# EAGLE design FanControllerv11 (EAGLE 6.4)
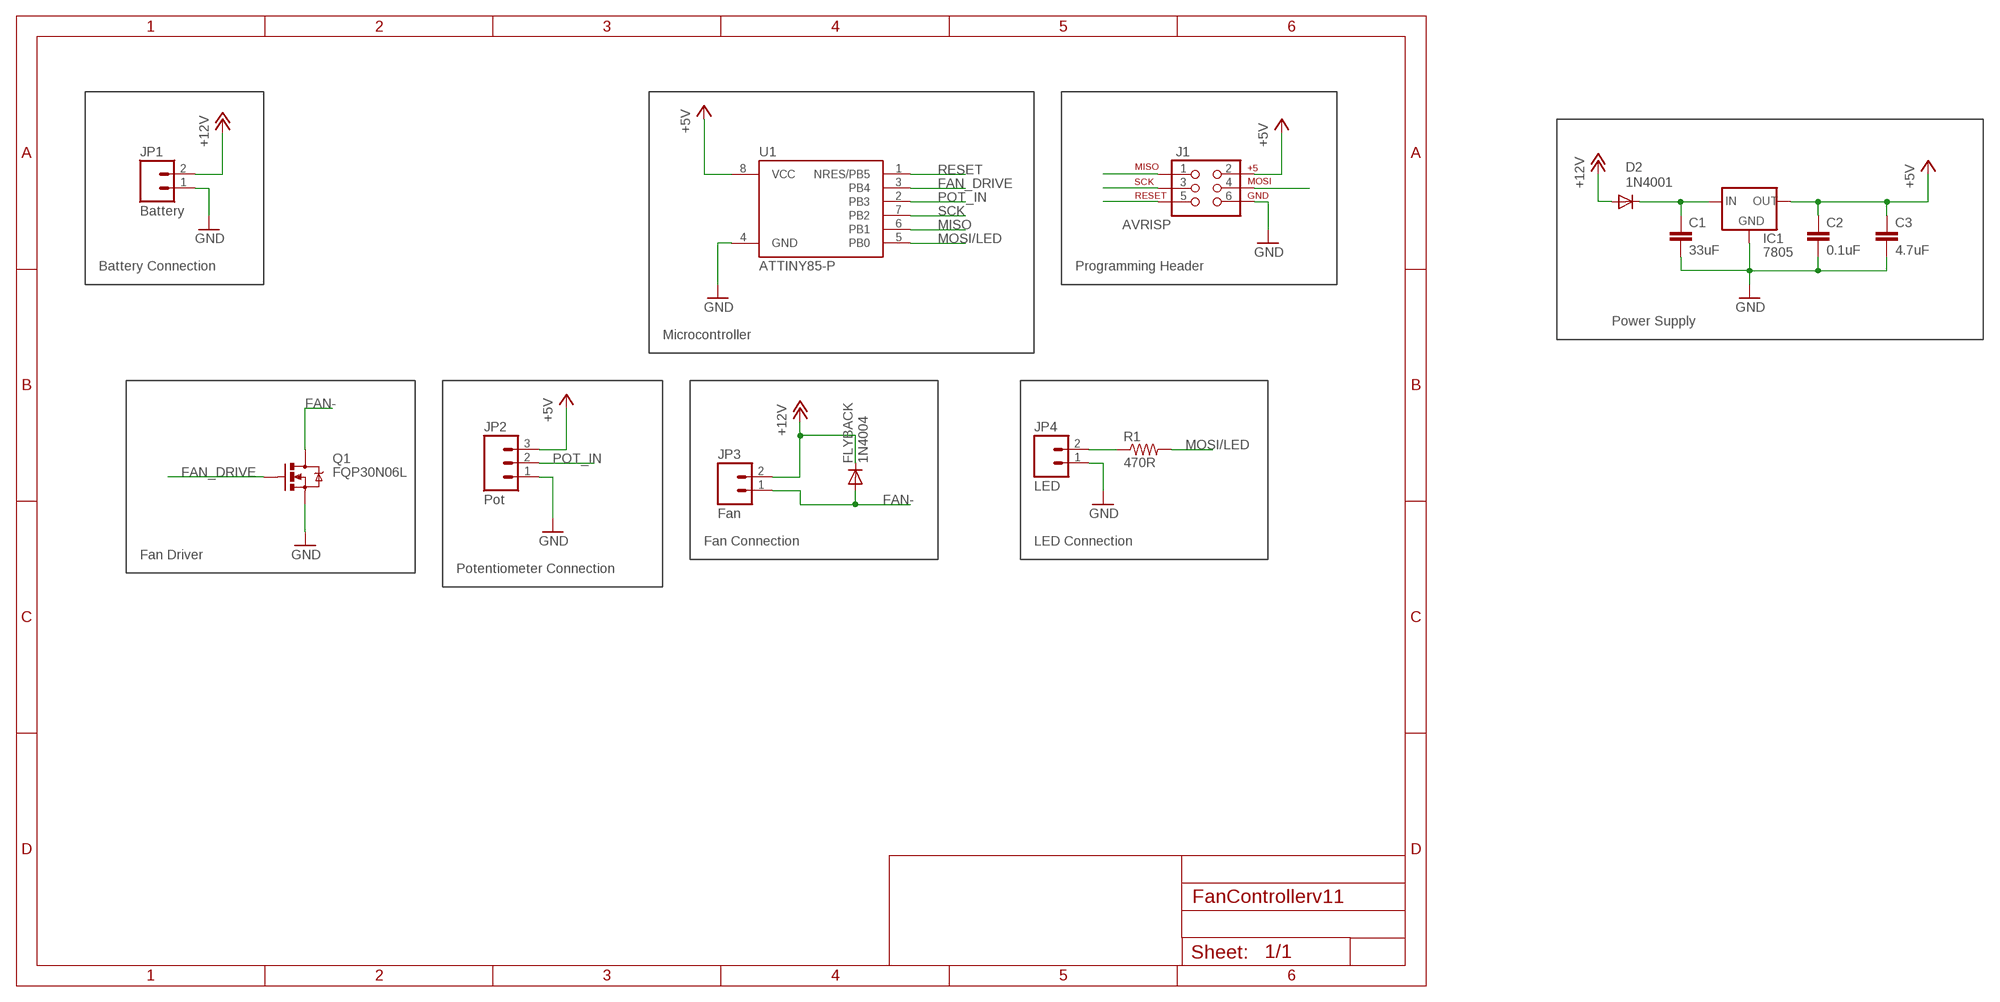
[diagram p0: schematic, sheet 1]

## Parts
C1  33uF  CAPPTH  [CAP-PTH-SMALL]
C2  0.1uF  CAPPTH3  [CAP-PTH-LARGE]
C3  4.7uF  CAPPTH  [CAP-PTH-SMALL]
D2  1N4001  DIODE1N4148  [DIODE-1N4148]
FLYBACK  1N4004  DIODE1N4148  [DIODE-1N4148]
IC1  7805  V_REG_78XXSIDE  [78XXL]
J1  AVRISP  AVR_SPI_PRG_6PTH  [2X3]
JP1  Battery  M02PTH4  [1X02_XTRA_BIG]
JP2  Pot  M03POLAR  [MOLEX-1X3]
JP3  Fan  M02PTH4  [1X02_XTRA_BIG]
JP4  LED  M02POLAR  [MOLEX-1X2]
Q1  FQP30N06L  MOSFET-NCHANNELFQP30N06L  [TO220V]
R1  470R  RESISTORAXIAL-0.3  [AXIAL-0.3]
U1  ATTINY85-P  [PDIP08_300MIL]

## Nets
+5V: C2.1 C3.1 IC1.OUT J1.2 JP2.3 U1.8(VCC)
+12V: D2.A FLYBACK.C JP1.2 JP3.2
FAN-: FLYBACK.A JP3.1 Q1.2(D)
FAN_DRIVE: Q1.1(G) U1.3(PB4)
GND: C1.2 C2.2 C3.2 IC1.GND J1.6 JP1.1 JP2.1 JP4.1 Q1.3(S) U1.4(GND)
MISO: J1.1 U1.6(PB1)
MOSI/LED: J1.4 R1.P$2 U1.5(PB0)
N$1: JP4.2 R1.P$1
N$2: C1.1 D2.C IC1.IN
POT_IN: JP2.2 U1.2(PB3)
RESET: J1.5 U1.1(NRES/PB5)
SCK: J1.3 U1.7(PB2)

## Notes on the sheet
- Battery Connection | Programming Header
- Power Supply
- Microcontroller
- Fan Connection | LED Connection
- Fan Driver
- Potentiometer Connection

## Library data of the parts
C1-C3 = SparkFun-Capacitors:CAP: Capacitor Standard 0603 ceramic capacitor, and 0.1" leaded capacitor.
D2 FLYBACK = SparkFun-DiscreteSemi:DIODE: Diode These are standard reverse protection diodes and small signal diodes. SMA package can handle up to about 1A. SOD-323 can handle about 200mA. What the SOD-323 package when ordering, there are some mfgs out there that are 5-pin packages.
IC1 = SparkFun-PowerIC:V_REG_78XX: Voltage Regulator Standard 7805 5V regulator. IGO (Input Ground Output). Spark Fun Electronics SKU : COM-00107
J1 = SparkFun-Connectors:AVR_SPI_PRG_6: AVR ISP 6 Pin This is the reduced ISP connector for AVR programming. Common on Arduino. This footprint will take up less PCB space and can be used with a 10-pin to 6-pin adapter such as SKU: BOB-08508
JP1 JP3 JP4 = SparkFun-Connectors:M02: Header 2 Standard 2-pin 0.1" header. Use with straight break away headers (SKU : PRT-00116), right angle break away headers (PRT-00553), swiss pins (PRT-00743), machine pins (PRT-00117), and female headers (PRT-00115). Molex polarized connector foot print use with SKU : PRT-08233 with associated crimp pins and housings.
JP2 = SparkFun-Connectors:M03: Header 3 Standard 3-pin 0.1" header. Use with straight break away headers (SKU : PRT-00116), right angle break away headers (PRT-00553), swiss pins (PRT-00743), machine pins (PRT-00117), and female headers (PRT-00115). Molex polarized connector foot print use with SKU : PRT-08232 with associated crimp pins and housings.
Q1 = SparkFun-DiscreteSemi:MOSFET-NCHANNEL: Common NMOSFET Parts MFG P/N Store ID Prod ID FDD8780 TRANS-09984 SI7820DN TRANS-11055 FDS6630A IC-08089 2N7002PW TRANS-11151 FQP30N06L COM-10213 TRANS-10060 BSS123LT1G TRANS-08345 BSS138 TRANS-00830 BS170 2N7000; PROD_ID: TRANS-10060
R1 = SparkFun-Resistors:RESISTOR: Resistor Basic schematic elements and footprints for 0603, 1206, and PTH resistors.
U1 = _hhn_attiny25_45_85:ATTINY85*: ATMEL ATtiny 85 Packages: P = PDIP 08 30mil S = SOIC 08 EIAJ 208mil Technologies Note: for complete ordering code (temp. range, finish, tape&reel etc.) see www.atmel.com • Supply Voltage: V = (1.8…5.5)V | [blank] = (2.7…5.5)V • Speed: 10 = 10 MHz | 20 = 20 MHz Author: Dipl.-Ing. FH Rainer Bayer HHN Hochschule Heilbronn (Heilbronn University), rainer.bayer@hs-heilbronn.de Ingenieurbüro ing-rb, mail@ing-rb.de

## Board
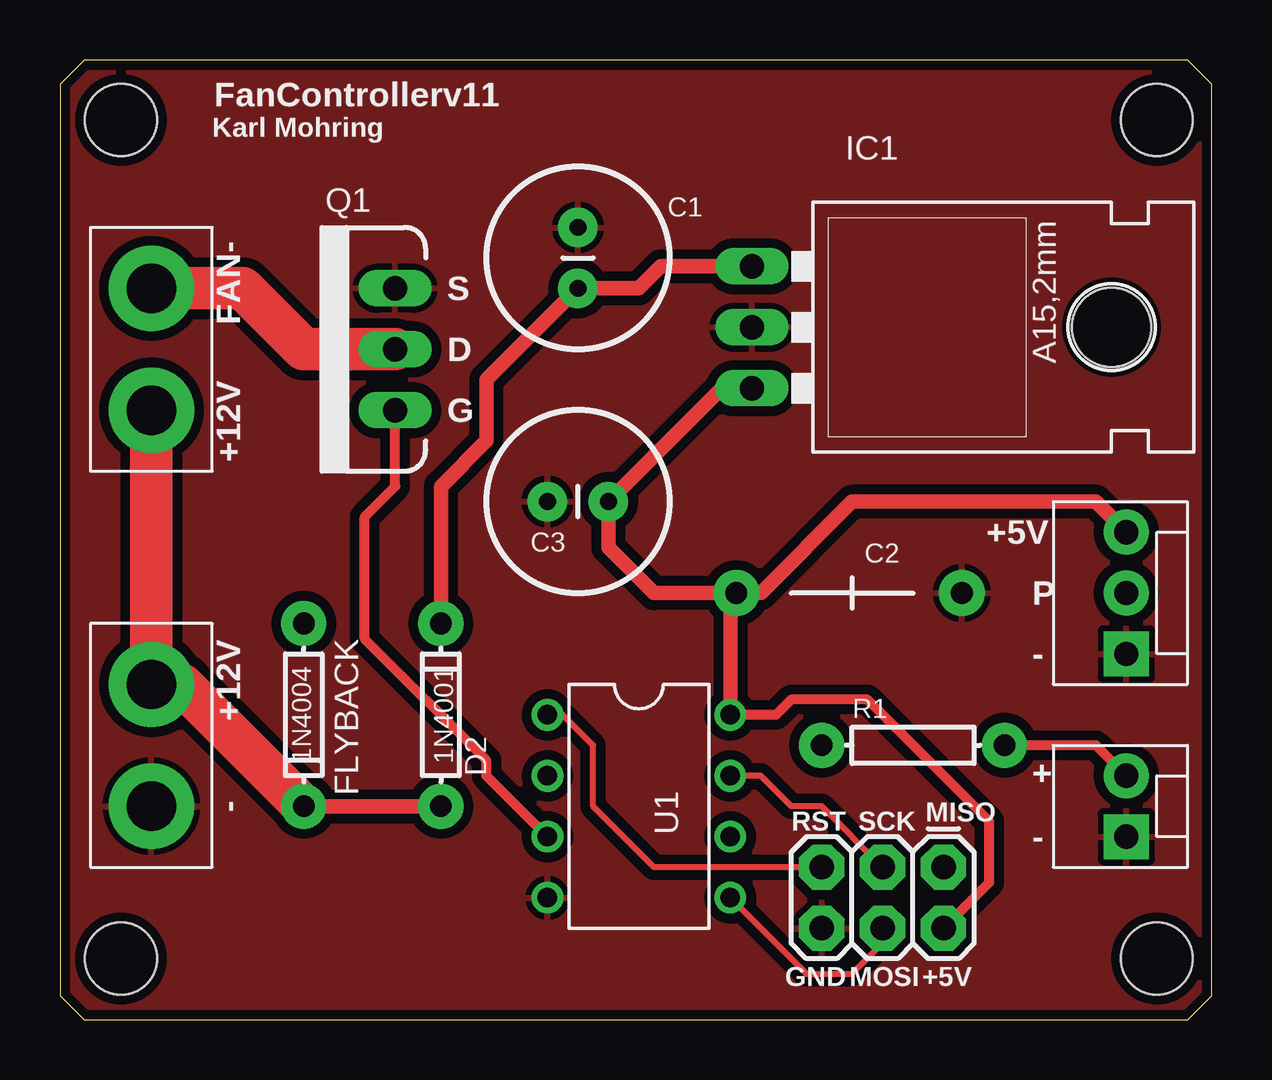
[diagram p1: board, top side]
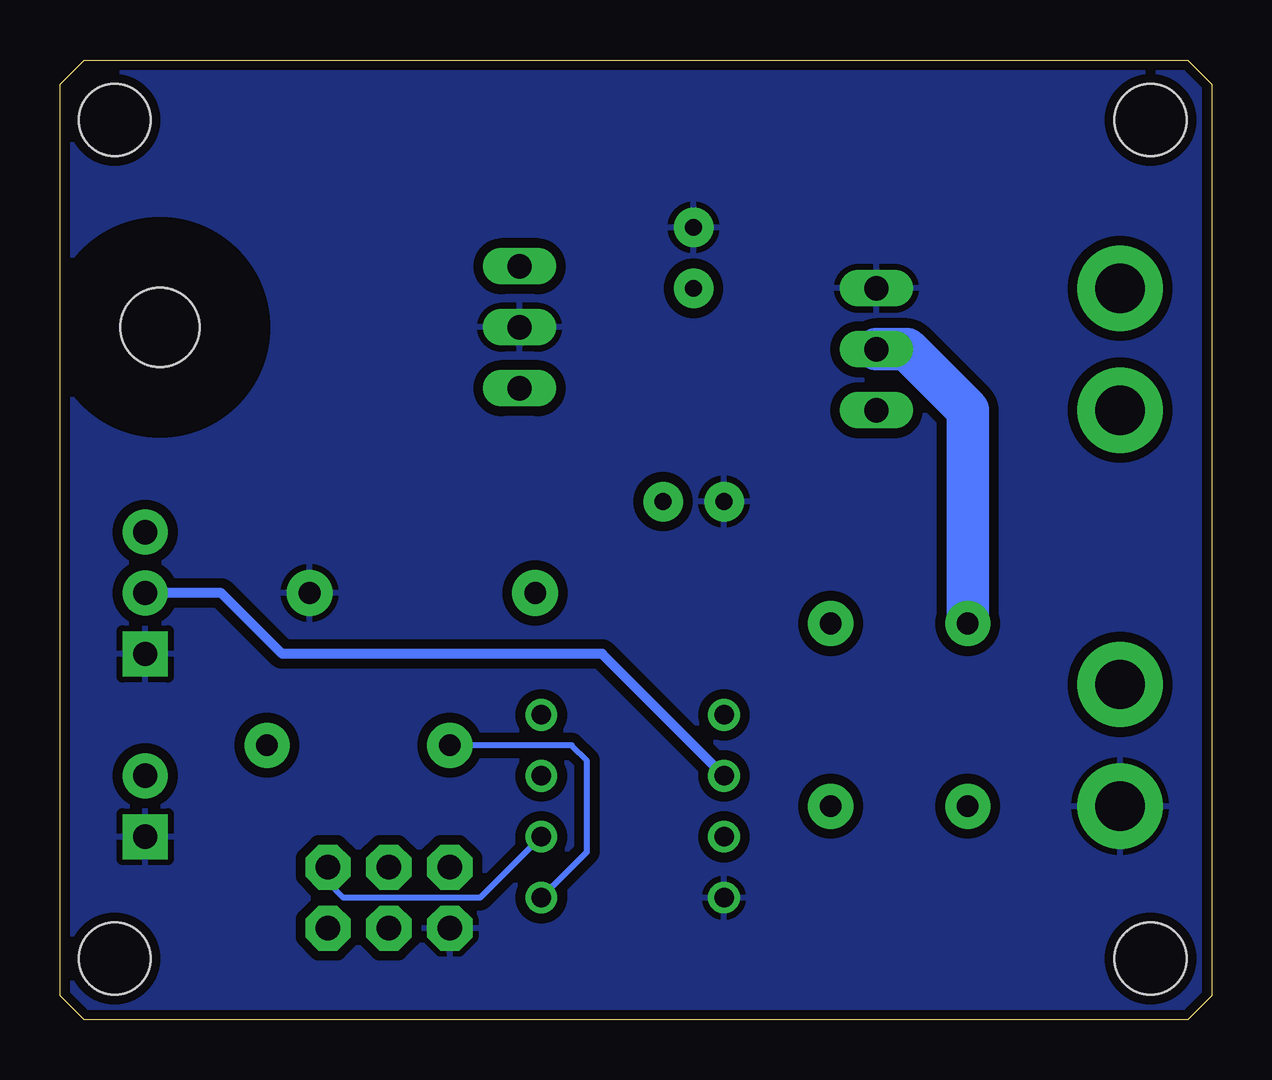
[diagram p2: board, bottom side, seen from below]

Size 48 x 40 mm. Coordinates in mm from the lower left corner, seen from the top.
Outline: 1,0 47,0 48,1 48,39 47,40 1,40 0,39 0,1 1,0
Copper layers (1*16): Top 0.035mm / dielectric 1.5mm / Bottom 0.035mm
Design rules "ITEADstudio_DRC": minimum track width 6mil, minimum drill 12mil, track to track 6mil, track to pad 6mil, pad to pad 6mil, via to via 6mil, smd to smd 0mil, copper to edge 10mil, drill to drill 10mil, minimum pad ring 10mil, minimum via ring 6mil, stop-mask expansion 2mil, vias tented up to drill 100mil, thermal gap 10mil
Holes 3 mm at 2.54,37.49 2.54,2.54 45.72,2.54 45.72,37.49

### Footprints (pad centres in the part's own frame; a part is rotated, then mirrored left to right if it is on the bottom)
CAP-PTH-SMALL = drill 0.7 pad 1.651: 1 0,0; 2 2.54,0
CAP-PTH-LARGE = drill 0.9 pad 1.905: 1 -4.826,0; 2 4.572,0
DIODE-1N4148 = drill 0.9 pad 1.88: A -3.81,0; C 3.81,0
78XXL = drill 1.016 long: GND 0,-3.81; IN -2.54,-3.81; OUT 2.54,-3.81 | hole 3.302: 0,11.176
2X3 = drill 1.016 pad 1.88 octagon: 1 0,0; 2 0,2.54; 3 2.54,0; 4 2.54,2.54; 5 5.08,0; 6 5.08,2.54
1X02_XTRA_BIG = drill 2.057 pad 3.556: 1 -2.54,0; 2 2.54,0
MOLEX-1X3 = drill 1.016 pad 1.88 square: 1 0,0 | drill 1.016 pad 1.88: 2 2.54,0; 3 5.08,0
MOLEX-1X2 = drill 1.016 pad 1.88 square: 1 0,0 | drill 1.016 pad 1.88: 2 2.54,0
TO220V = drill 1.016 long: 1 -2.54,0; 2 0,0; 3 2.54,0
AXIAL-0.3 = drill 0.9 pad 1.88: P$1 -3.81,0; P$2 3.81,0
PDIP08_300MIL = drill 0.813: 1 -3.81,-3.81; 2 -1.27,-3.81; 3 1.27,-3.81; 4 3.81,-3.81; 5 3.81,3.81; 6 1.27,3.81; 7 -1.27,3.81; 8 -3.81,3.81

### Placement (x,y rotation side)
C1  21.59,30.48 90 top
C2  33.02,17.78 0 top
C3  22.86,21.59 180 top
D2  15.88,12.7 90 top
FLYBACK  10.16,12.7 270 top
IC1  32.66,28.86 270 top
J1  36.83,6.35 180 top
JP1  3.81,11.43 90 top
JP2  44.45,15.24 90 top
JP3  3.81,27.94 270 top
JP4  44.45,7.62 90 top
Q1  13.97,27.94 90 top
R1  35.56,11.43 180 top
U1  24.13,8.89 270 top

### Tracks (layer width: path | path; a pad name or v marks a point on that pad's centre or on a via)
+5V
  Top 0.406: J1.2 38.73,5.71 38.73,8.26 33.66,13.34 30.48,13.34 29.84,12.7 U1.8
  Top 0.61: C2.1 27.94,17.53 U1.8 | JP2.3 43.18,21.59 33.02,21.59 29.21,17.78 C2.1 | IC1.OUT 27.59,26.32 C3.1 22.86,19.68 24.77,17.78 C2.1
+12V
  Top 0.61: FLYBACK.C D2.A
  Top 1.778: JP3.2 JP1.2 5.08,13.97 FLYBACK.C
FAN-
  Top 1.778: JP3.1 7.62,30.48 10.16,27.94 Q1.2
  Bottom 1.778: FLYBACK.A 10.16,25.4 12.7,27.94 Q1.2
FAN_DRIVE
  Top 0.406: U1.3 17.78,10.16 17.78,10.79 12.7,15.88 12.7,20.95 13.97,22.23 Q1.1
GND
  pour Bottom (isolate 0.406): 1,0 0,1 0,39 1,40 47,40 48,39 48,1 47,0
  pour Top (isolate 0.406): 1,40 47,40 48,39 48,1 47,0 1,0 0,1 0,39
MISO
  Bottom 0.254: U1.6 30.48,5.08 36.2,5.08 36.83,5.71 J1.1
MOSI/LED
  Top 0.254: U1.5 31.11,1.91 33.02,1.91 34.29,3.17 J1.4
  Bottom 0.254: U1.5 26.04,6.99 26.04,10.79 26.67,11.43 R1.P$2
N$1
  Top 0.406: JP4.2 43.18,11.43 R1.P$1
N$2
  Top 0.61: D2.C 15.88,22.23 17.78,24.13 17.78,26.67 C1.1 24.13,30.48 25.05,31.4 IC1.IN
POT_IN
  Bottom 0.406: U1.2 25.4,15.24 38.73,15.24 41.27,17.78 JP2.2
RESET
  Top 0.254: J1.5 24.77,6.35 22.23,8.89 22.23,11.43 20.95,12.7 U1.1
SCK
  Top 0.254: J1.3 31.75,8.89 30.48,8.89 29.21,10.16 U1.7

### Text on the board
tPlace: Karl Mohring | S | FAN- | D | G | +12V | +5V | P | - | +12V | + | - | RST | SCK | MISO | - | GND | MOSI | +5V